# EAGLE design STMBreadboard (EAGLE 7.2.0)
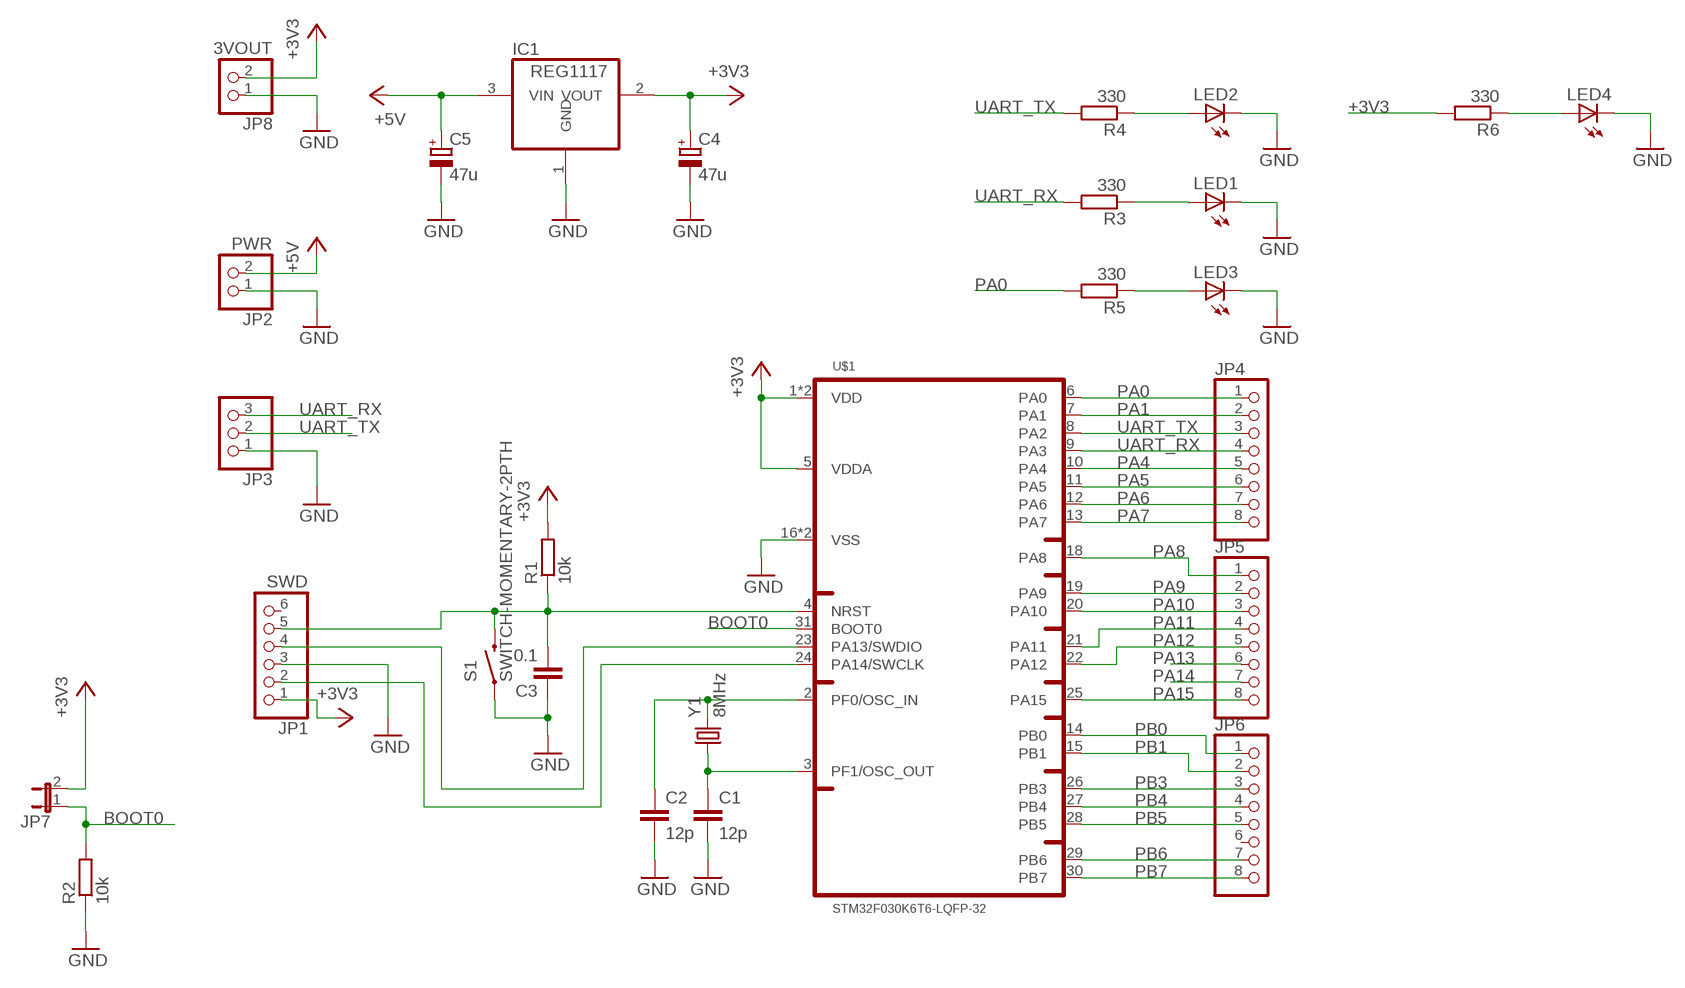
[diagram p0: schematic, sheet 1]

## Parts
C1  12p  C-EUC0805  [C0805]
C2  12p  C-EUC0805  [C0805]
C3  0.1  C-EUC0805  [C0805]
C4  47u  CPOL-EUUD-6,3X7,7  [UD-6,3X7,7_NICHICON]
C5  47u  CPOL-EUUD-6,3X7,7  [UD-6,3X7,7_NICHICON]
IC1  REG1117  [SOT223]
JP1  SWD  PINHD-1X6  [1X06]
JP2  PWR  PINHD-1X2  [1X02]
JP3  PINHD-1X3  [1X03]
JP4  PINHD-1X8  [1X08]
JP5  PINHD-1X8  [1X08]
JP6  PINHD-1X8  [1X08]
JP7  JP1E  [JP1]
JP8  3VOUT  PINHD-1X2  [1X02]
LED1  LEDCHIPLED_0603  [CHIPLED_0603]
LED2  LEDCHIPLED_0603  [CHIPLED_0603]
LED3  LEDSML0603  [SML0603]
LED4  LEDSML0603  [SML0603]
R1  10k  R-EU_R1206  [R1206]
R2  10k  R-EU_R1206  [R1206]
R3  330  R-EU_R1206  [R1206]
R4  330  R-EU_R1206  [R1206]
R5  330  R-EU_R1206  [R1206]
R6  330  R-EU_R1206  [R1206]
S1  SWITCH-MOMENTARY-2PTH  [TACTILE-PTH]
U$1  STM32F030K6T6-LQFP-32  [LQFP-32]
Y1  8MHz  CRYSTALSMD  [HC49UP]

## Nets
+3V3: C4.+ IC1.2(VOUT) JP1.1 JP7.2 JP8.2 R1.2 R6.2 U$1.1(VDD) U$1.5(VDDA) U$1.17(VDD)
+5V: C5.+ IC1.3(VIN) JP2.2
BOOT0: JP7.1 R2.2 U$1.31(BOOT0)
GND: C1.2 C2.2 C3.1 C4.- C5.- IC1.1(GND) JP1.3 JP2.1 JP3.1 JP8.1 LED1.C LED2.C LED3.C LED4.C R2.1 S1.1 U$1.16(VSS) U$1.32(VSS)
N$1: C2.1 U$1.2(PF0/OSC_IN) Y1.2
N$2: C1.1 U$1.3(PF1/OSC_OUT) Y1.1
N$3: C3.2 JP1.5 R1.1 S1.3 U$1.4(NRST)
N$4: LED1.A R3.1
N$5: LED2.A R4.1
N$6: LED3.A R5.1
N$7: LED4.A R6.1
PA0: JP4.1 R5.2 U$1.6(PA0)
PA1: JP4.2 U$1.7(PA1)
PA4: JP4.5 U$1.10(PA4)
PA5: JP4.6 U$1.11(PA5)
PA6: JP4.7 U$1.12(PA6)
PA7: JP4.8 U$1.13(PA7)
PA8: JP5.1 U$1.18(PA8)
PA9: JP5.2 U$1.19(PA9)
PA10: JP5.3 U$1.20(PA10)
PA11: JP5.4 U$1.21(PA11)
PA12: JP5.5 U$1.22(PA12)
PA13: JP1.4 JP5.6 U$1.23(PA13/SWDIO)
PA14: JP1.2 JP5.7 U$1.24(PA14/SWCLK)
PA15: JP5.8 U$1.25(PA15)
PB0: JP6.1 U$1.14(PB0)
PB1: JP6.2 U$1.15(PB1)
PB3: JP6.3 U$1.26(PB3)
PB4: JP6.4 U$1.27(PB4)
PB5: JP6.5 U$1.28(PB5)
PB6: JP6.7 U$1.29(PB6)
PB7: JP6.8 U$1.30(PB7)
UART_RX: JP3.3 JP4.4 R3.2 U$1.9(PA3)
UART_TX: JP3.2 JP4.3 R4.2 U$1.8(PA2)
Unconnected: JP1.6 JP6.6

## Library data of the parts
C1-C3 = rcl:C-EU: CAPACITOR, European symbol
C4 C5 = rcl:CPOL-EU: POLARIZED CAPACITOR, European symbol
IC1 = burr-brown:REG1117: 800mA and 1A Low Dropout (LDO) Positive Regulator 1.8V, 2.5V, 2.85V, 3.3V, 5V, and Adj; MPN: REG1117; OC_FARNELL: 1097566; OC_NEWARK: 14P6981
JP1 = pinhead:PINHD-1X6: PIN HEADER
JP2 JP8 = pinhead:PINHD-1X2: PIN HEADER
JP3 = pinhead:PINHD-1X3: PIN HEADER
JP4-JP6 = pinhead:PINHD-1X8: PIN HEADER
JP7 = jumper:JP1E: JUMPER
LED1-LED4 = led:LED: LED OSRAM: - CHIPLED LG R971, LG N971, LY N971, LG Q971, LY Q971, LO R971, LY R971 LH N974, LH R974 LS Q976, LO Q976, LY Q976 LO Q996 - Hyper CHIPLED LW Q18S LB Q993, LB Q99A, LB R99A - SideLED LS A670, LO A670, LY A670, LG A670, LP A670 LB A673, LV A673, LT A673, LW A673 LH A674 LY A675 LS A676, LA A676, LO A676, LY A676, LW A676 LS A679, LY A679, LG A679 - Hyper Micro SIDELED® LS Y876, LA Y876, LO Y876, LY Y876 LT Y87S - SmartLED LW L88C, LW L88S LB L89C, LB L89S, LG L890 LS L89K, LO L89K, LY L89K LS L896, LA L896, LO L896, LY L896 - TOPLED LS T670, LO T670, LY T670, LG T670, LP T670 LSG T670, LSP T670, LSY T670, LOP T670, LYG T670 LG T671, LOG T671, LSG T671 LB T673, LV T673, LT T673, LW T673 LH T674 LS T676, LA T676, LO T676, LY T676, LB T676, LH T676, LSB T676, LW T676 LB T67C, LV T67C, LT T67C, LS T67K, LO T67K, LY T67K, LW E67C LS E67B, LA E67B, LO E67B, LY E67B, LB E67C, LV E67C, LT E67C LW T67C LS T679, LY T679, LG T679 LS T770, LO T770, LY T770, LG T770, LP T770 LB T773, LV T773, LT T773, LW T773 LH T774 LS E675, LA E675, LY E675, LS T675 LS T776, LA T776, LO T776, LY T776, LB T776 LHGB T686 LT T68C, LB T68C - Hyper Mini TOPLED® LB M676 - Mini TOPLED Santana® LG M470 LS M47K, LO M47K, LY M47K Source: http://www.osram.convergy.de LUXEON: - LUMILED® LXK2-PW12-R00, LXK2-PW12-S00, LXK2-PW14-U00, LXK2-PW14-V00 LXK2-PM12-R00, LXK2-PM12-S00, LXK2-PM14-U00 LXK2-PE12-Q00, LXK2-PE12-R00, LXK2-PE12-S00, LXK2-PE14-T00, LXK2-PE14-U00 LXK2-PB12-K00, LXK2-PB12-L00, LXK2-PB12-M00, LXK2-PB14-N00, LXK2-PB14-P00, LXK2-PB14-Q00 LXK2-PR12-L00, LXK2-PR12-M00, LXK2-PR14-Q00, LXK2-PR14-R00 LXK2-PD12-Q00, LXK2-PD12-R00, LXK2-PD12-S00 LXK2-PH12-R00, LXK2-PH12-S00 LXK2-PL12-P00, LXK2-PL12-Q00, LXK2-PL12-R00 Source: www.luxeon.com KINGBRIGHT: KA-3528ASYC Source: www.kingbright.com
R1-R6 = rcl:R-EU_: RESISTOR, European symbol
S1 = SparkFun-Electromechanical:SWITCH-MOMENTARY-2: Various NO switches- pushbuttons, reed, etc
U$1 = stm32xx:STM32F030K6T6
Y1 = SparkFun-FreqCtrl:CRYSTAL: Various standard crystals. Proven footprints.

## Board
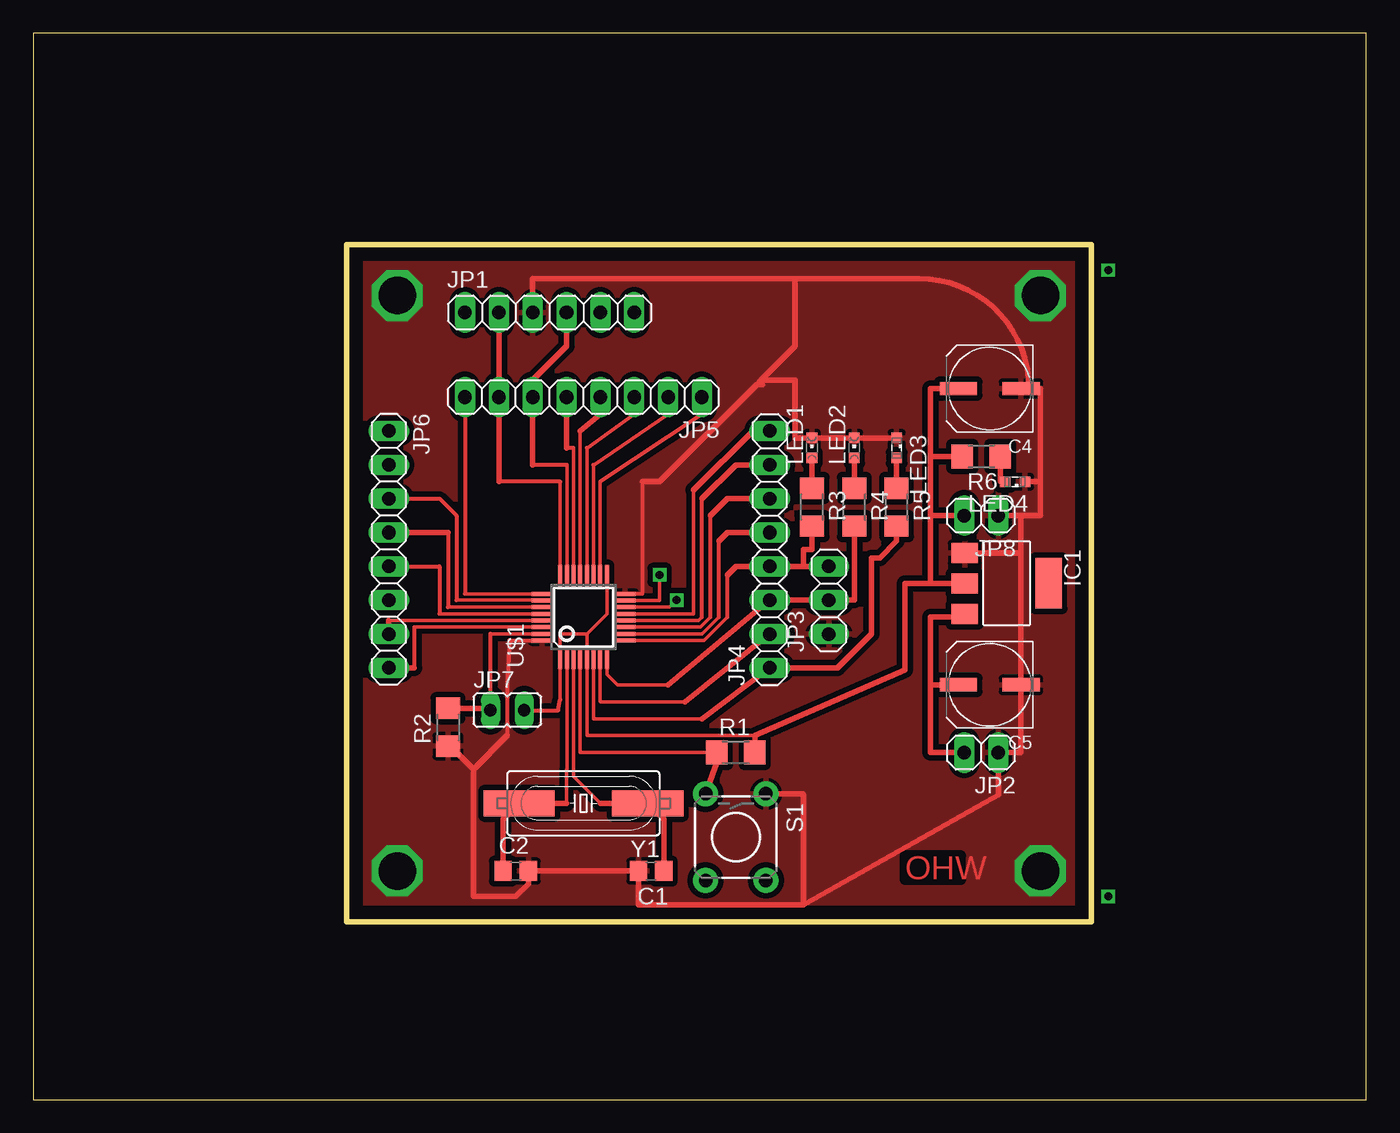
[diagram p1: board, top side]
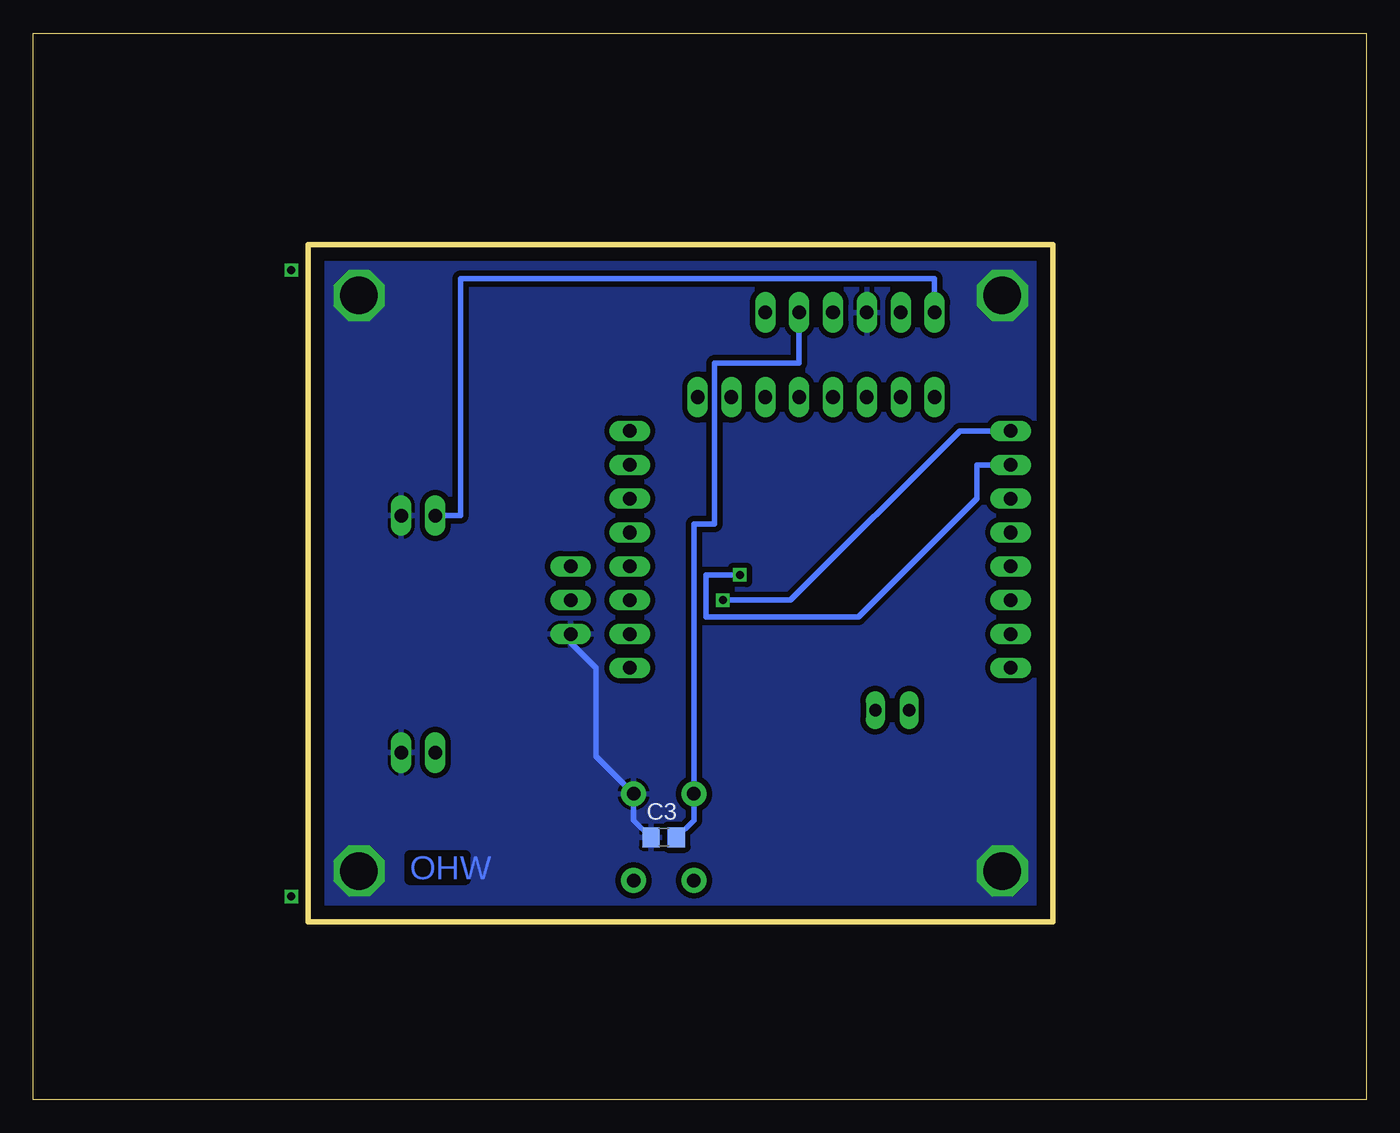
[diagram p2: board, bottom side, seen from below]

Size 100 x 80 mm. Coordinates in mm from the lower left corner, seen from the top.
Outline: 0,0 100,0 100,80 0,80 0,0
Outline: 23.5,64.14 79.38,64.14 79.38,13.34 23.5,13.34 23.5,64.14
Copper layers (1*16): Top 0.035mm / dielectric 1.5mm / Bottom 0.035mm
Design rules "default": minimum track width 10mil, minimum drill 24mil, track to track 8mil, track to pad 8mil, pad to pad 8mil, via to via 8mil, smd to smd 8mil, copper to edge 40mil, drill to drill 8mil, minimum pad ring 10mil, minimum via ring 8mil, stop-mask expansion 4mil, vias tented up to drill 0mil, thermal gap 10mil

### Footprints (pad centres in the part's own frame; a part is rotated, then mirrored left to right if it is on the bottom)
C0805 = smd 1.3 x 1.5: 1 -0.95,0; 2 0.95,0
UD-6,3X7,7_NICHICON = smd 2.8 x 1: + 2.35,0; - -2.35,0
SOT223 = smd 1.499 x 2.007: 1 -2.261,-3.15; 2 0.025,-3.15; 3 2.311,-3.15 | smd 3.81 x 2.007: 4 0,3.15
1X06 = drill 1.016 long: 1 -6.35,0; 2 -3.81,0; 3 -1.27,0; 4 1.27,0; 5 3.81,0; 6 6.35,0
1X02 = drill 1.016 long: 1 -1.27,0; 2 1.27,0
1X03 = drill 1.016 long: 1 -2.54,0; 2 0,0; 3 2.54,0
1X08 = drill 1.016 long: 1 -8.89,0; 2 -6.35,0; 3 -3.81,0; 4 -1.27,0; 5 1.27,0; 6 3.81,0; 7 6.35,0; 8 8.89,0
JP1 = drill 0.914 long: 1 0,-1.27; 2 0,1.27
CHIPLED_0603 = smd 0.8 x 0.8: A 0,-0.75; C 0,0.75
SML0603 = smd 0.8 x 0.8: A 0.75,0; C -0.75,0
R1206 = smd 1.6 x 1.803: 1 -1.422,0; 2 1.422,0
TACTILE-PTH = drill 1.016 pad 1.88: 1 -3.251,2.261; 2 3.251,2.261; 3 -3.251,-2.261; 4 3.251,-2.261
LQFP-32 = smd 0.3 x 1.6: 1 -1.75,-3.1; 2 -1.25,-3.1; 3 -0.75,-3.1; 4 -0.25,-3.1; 5 0.25,-3.1; 6 0.75,-3.1; 7 1.25,-3.1; 8 1.75,-3.1; 17 1.75,3.1; 18 1.25,3.1; 19 0.75,3.1; 20 0.25,3.1; 21 -0.25,3.1; 22 -0.75,3.1; 23 -1.25,3.1; 24 -1.75,3.1 | smd 1.6 x 0.3: 9 3.1,-1.75; 10 3.1,-1.25; 11 3.1,-0.75; 12 3.1,-0.25; 13 3.1,0.25; 14 3.1,0.75; 15 3.1,1.25; 16 3.1,1.75; 25 -3.1,1.75; 26 -3.1,1.25; 27 -3.1,0.75; 28 -3.1,0.25; 29 -3.1,-0.25; 30 -3.1,-0.75; 31 -3.1,-1.25; 32 -3.1,-1.75
HC49UP = smd 5.334 x 1.93: 1 -4.826,0; 2 4.826,0

### Placement (x,y rotation side)
C1  46.35,17.14 180 top
C2  36.2,17.14 0 top
C3  52.7,19.68 0 bottom
C4  71.75,53.34 180 top
C5  71.75,31.11 180 top
IC1  73.03,38.73 270 top
JP1  38.73,59.05 0 top
JP2  71.12,26.04 180 top
JP3  59.69,37.47 90 top
JP4  55.24,41.27 90 top
JP5  41.27,52.7 180 top
JP6  26.67,41.27 270 top
JP7  35.56,29.21 270 top
JP8  71.12,43.81 180 top
LED1  58.42,48.9 0 top
LED2  61.59,48.9 0 top
LED3  64.77,48.9 270 top
LED4  73.66,46.35 180 top
R1  52.7,26.04 0 top
R2  31.11,27.94 90 top
R3  58.42,44.45 270 top
R4  61.59,44.45 270 top
R5  64.77,44.45 270 top
R6  71.12,48.26 180 top
S1  52.7,19.68 270 top
U$1  41.27,36.2 0 top
Y1  41.27,22.23 180 top

### Tracks (layer width: path | path; a pad name or v marks a point on that pad's centre or on a via)
+3V3
  Top 0.254: 54.13,27.3 41.52,27.3 U$1.5 41.52,34.92 | 41.52,34.92 39.52,34.92 U$1.1 39.52,30 | U$1.17 43.02,36.42 41.52,34.92
  Top 0.305: JP7.2 39.37,29.21 39.52,30
  Top 0.406: R1.2 54.13,27.3 65.41,32.23 65.41,38.73 65.43,38.71 IC1.2 67.31,38.71 67.31,43.81 | JP8.2 67.31,43.81 | 67.31,43.81 67.31,48.26 | R6.2 67.31,48.26 | 67.31,48.26 67.31,53.34 C4.+
  Bottom 0.406: JP1.1 32.38,61.59 67.94,61.59 67.94,43.81 JP8.2
+5V
  Top 0.406: C5.+ 67.31,31.11 | 67.31,31.11 67.31,36.2 69.88,36.2 IC1.3 | 67.31,31.11 67.31,26.04 JP2.2
BOOT0
  Top 0.254: 34.29,34.95 U$1.31
  Top 0.305: JP7.1 34.29,34.95
  Top 0.406: R2.2 34.14,29.36 JP7.1
GND  (via drill 2.8, 2.8 pad 1.68)
  Top 0.254: U$1.16 45.72,37.95 45.72,46.35 | U$1.32 35.72,34.45
  Top 0.305: 35.72,34.45 35.56,31.11 35.56,27.3
  Top 0.406: 74.11,41 C5.- 74.11,26.04 JP2.1 72.39,22.86 57.78,14.61 | 74.11,41 74.11,43.81 | IC1.1 74.11,41 | 57.78,14.61 45.41,14.61 C1.2 C2.2 37.15,16.19 36.2,15.24 33.02,15.24 33.02,24.77 | JP1.3 37.47,61.59 57.15,61.59 | JP8.1 74.11,43.81 | 74.71,53.34 C4.- | 57.15,61.59 66.45,61.59 arc-90 74.71,53.34 | 45.72,46.35 46.99,46.35 54.29,53.66 | 54.29,53.66 54.61,53.98 | 54.61,53.98 57.15,56.52 57.15,61.59 | 57.78,14.61 57.78,22.86 57.71,22.94 S1.1 | 35.56,27.3 33.02,24.77 | R2.1 31.27,26.52 33.02,24.77 | 54.71,53.66 54.29,53.66 | LED3.C LED2.C LED1.C 57.15,49.65 57.15,53.98 54.61,53.98 | 75.56,46.35 75.56,43.81 74.11,43.81 | LED4.C 75.56,46.35 | 75.56,46.35 75.56,53.34 74.71,53.34
  Bottom 0.406: C3.1 54.97,20.95 S1.1 57.78,25.76 57.78,32.38 59.69,34.29 JP3.1
  other vias: 75.56,17.14 27.3,17.14 75.56,60.33 27.3,60.33
  pour Top (isolate 0.406): 24.13,63.5 78.74,63.5 78.74,13.97 24.13,13.97
  pour Bottom (isolate 0.406): 24.13,63.5 78.74,63.5 78.74,13.97 24.13,13.97
N$1
  Top 0.254: U$1.2 40.02,24.79 40.01,24.77 40.01,22.23
  Top 0.406: C2.1 35.24,21.02 Y1.2 40.01,22.23
N$2
  Top 0.254: U$1.3 40.52,24.25 42.55,22.23
  Top 0.406: C1.1 47.3,21.02 Y1.1 42.55,22.23
N$3
  Top 0.254: U$1.4 41.02,26.04 51.44,26.04
  Top 0.406: S1.3 51.44,25.76 51.44,26.04 R1.1
  Bottom 0.406: C3.2 50.44,20.95 S1.3 50.44,43.18 48.9,43.18 48.9,55.24 42.55,55.24 JP1.5
N$4
  Top 0.406: LED1.A R3.1
N$5
  Top 0.406: LED2.A R4.1
N$6
  Top 0.406: LED3.A R5.1
N$7
  Top 0.406: LED4.A 72.54,46.35 R6.1
N$8  (via drill 0.6)
  other vias: 80.64,62.23
N$9  (via drill 0.6)
  other vias: 80.64,15.24
PA0
  Top 0.254: 50.16,28.57 42.02,28.57 U$1.6
  Top 0.406: 50.16,28.57 JP4.1 60.33,32.38 62.87,34.92 62.87,40.64 63.5,40.64 64.77,41.91 R5.2
PA1
  Top 0.254: 48.9,29.84 42.55,29.84 42.52,29.86 U$1.7
  Top 0.406: JP4.2 48.9,29.84
PA4
  Top 0.254: U$1.10 50.15,34.95 50.16,34.92 51.44,36.2
  Top 0.305: 51.44,36.2 51.44,41.91
  Top 0.406: 51.44,41.91 52.07,42.55 JP4.5
PA5
  Top 0.254: U$1.11 50.05,35.45 50.8,36.2
  Top 0.305: 50.8,36.2 50.8,43.81
  Top 0.406: 50.8,43.81 52.07,45.09 JP4.6
PA6
  Top 0.254: U$1.12 49.91,35.95 50.16,36.2
  Top 0.305: 50.16,36.2 50.16,45.09
  Top 0.406: 50.16,45.09 52.7,47.62 JP4.7
PA7
  Top 0.254: U$1.13 49.53,36.45 49.53,45.72
  Top 0.406: 49.53,45.72 53.98,50.16 JP4.8
PA8
  Top 0.254: U$1.18 42.52,46.35
  Top 0.305: 42.52,46.35 50.16,51.44
  Top 0.406: 50.16,51.44 JP5.1
PA9
  Top 0.254: U$1.19 42.02,47.62
  Top 0.305: 42.02,47.62 47.62,51.44
  Top 0.406: 47.62,51.44 JP5.2
PA10
  Top 0.254: U$1.20 41.52,48.9
  Top 0.305: 41.52,48.9 45.09,51.44
  Top 0.406: 45.09,51.44 JP5.3
PA11
  Top 0.254: U$1.21 41.02,50.16
  Top 0.406: 41.02,50.16 42.55,51.44 JP5.4
PA12
  Top 0.254: U$1.22 40.52,48.9
  Top 0.305: 40.52,48.9 40.01,48.9
  Top 0.406: 40.01,48.9 JP5.5
PA13
  Top 0.254: U$1.23 40.02,47.62
  Top 0.305: 40.02,47.62 37.47,47.62
  Top 0.406: 37.47,47.62 JP5.6 37.47,53.98 40.01,56.52 JP1.4
PA14
  Top 0.254: U$1.24 39.52,46.35
  Top 0.305: 39.52,46.35 34.92,46.35
  Top 0.406: 34.92,46.35 JP5.7 JP1.2
PA15
  Top 0.254: 32.38,37.95 U$1.25
  Top 0.305: JP5.8 32.38,37.95
PB0  (via drill 0.6)
  Top 0.254: v48.26,37.47 47.74,36.95 U$1.14
  Bottom 0.406: JP6.1 30.48,50.16 43.18,37.47 v48.26,37.47
PB1  (via drill 0.6)
  Top 0.254: v46.99,39.37 46.99,37.45 U$1.15
  Bottom 0.406: v46.99,39.37 49.53,39.37 49.53,36.2 38.1,36.2 29.21,45.09 29.21,47.62 JP6.2
PB3
  Top 0.254: 31.75,37.47 38.16,37.47
  Top 0.305: JP6.3 30.48,45.09 31.75,43.81 31.75,37.47 | 38.16,37.47 U$1.26
PB4
  Top 0.254: 31.11,36.95 U$1.27
  Top 0.305: 31.11,42.55 31.11,36.95
  Top 0.406: JP6.4 31.11,42.55
PB5
  Top 0.254: 30.48,36.45 U$1.28
  Top 0.305: JP6.5 30.48,40.01 30.48,36.45
PB6
  Top 0.254: 26.67,35.95 U$1.29
  Top 0.406: JP6.7 26.67,35.95
PB7
  Top 0.254: U$1.30 28.57,35.45
  Top 0.305: 28.57,35.45 28.57,32.38
  Top 0.406: 28.57,32.38 JP6.8
UART_RX
  Top 0.254: U$1.9 50.32,34.45 52.07,36.2
  Top 0.305: 52.07,36.2 52.07,39.37
  Top 0.406: 52.07,39.37 52.7,40.01 JP4.4 57.78,40.01 | JP3.3 57.78,40.01 | R3.2 58.42,41.27 57.78,41.27 57.78,40.01
UART_TX
  Top 0.254: 47.62,31.11 43.81,31.11 43.02,31.91 U$1.8
  Top 0.406: 47.62,31.11 JP4.3 JP3.2 61.59,37.47 R4.2

### Text on the board
Top: OHW
Bottom: OHW